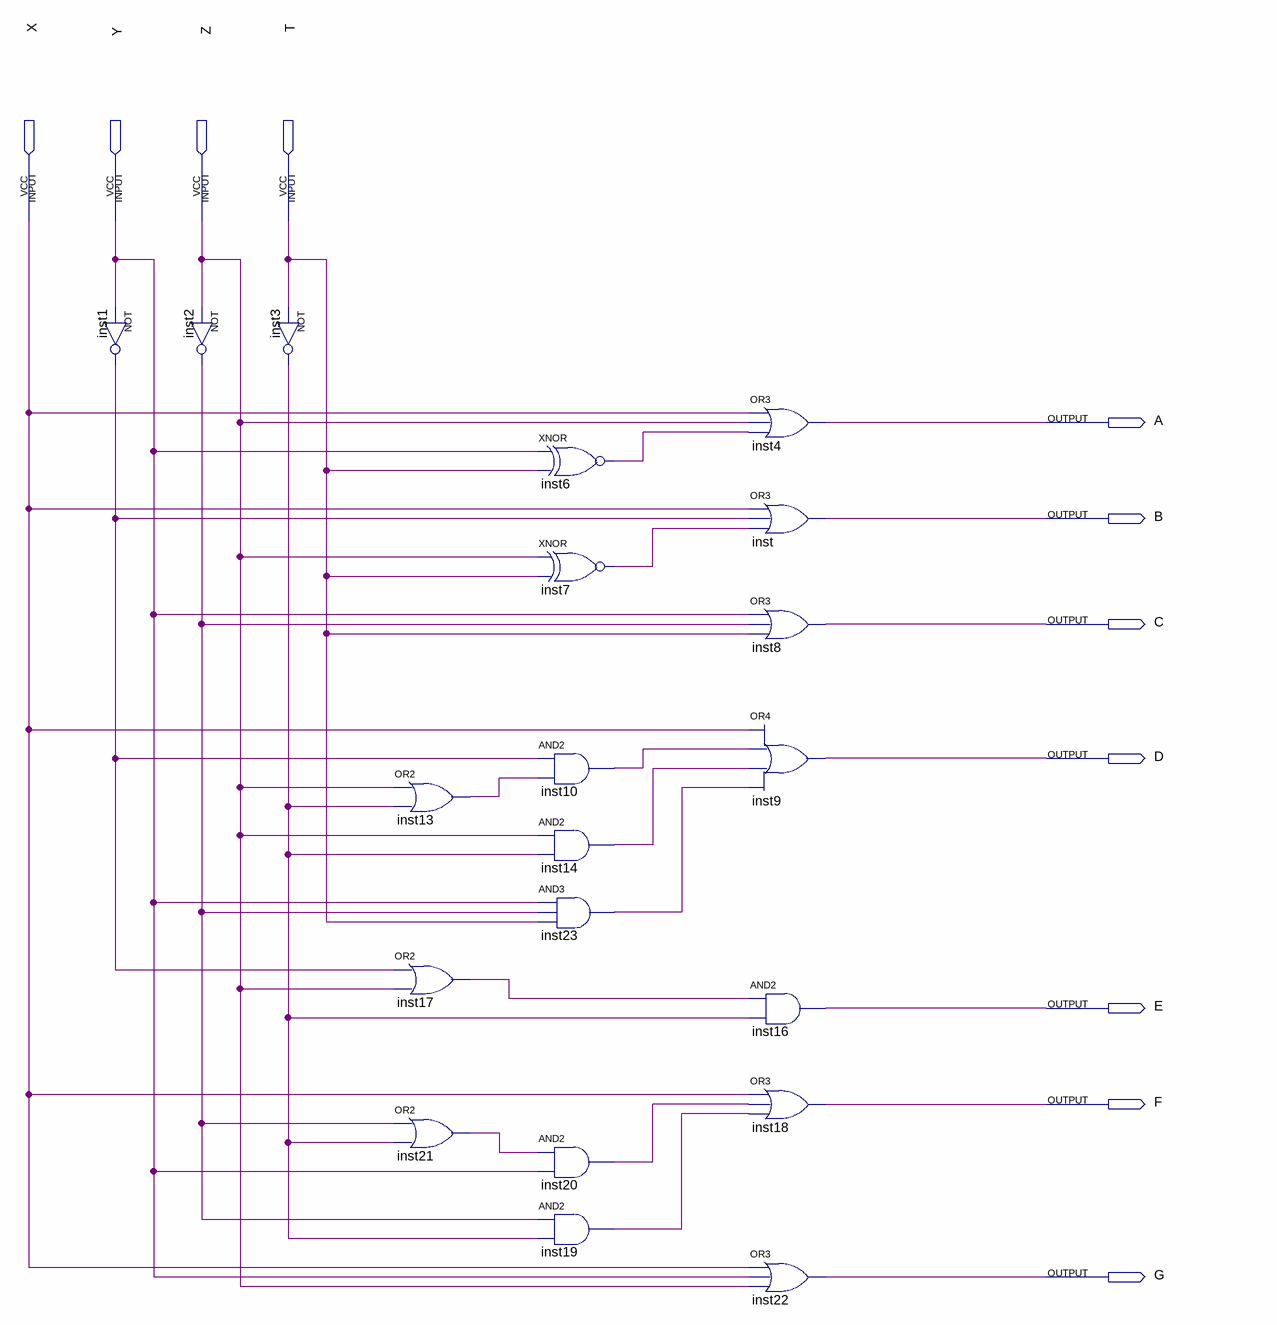
[diagram p0: schematic sheet]
// Quartus schematic NMMS3.bdf as structural Verilog: 20 symbols, 11 pins
module NMMS3 (
  input  X,
  input  Y,
  input  Z,
  input  T,
  output A,
  output B,
  output C,
  output D,
  output E,
  output F,
  output G
);

  wire inst1_out, inst2_out, inst3_out, inst6_out, inst7_out, inst10_out, inst13_out, inst14_out, inst17_out,
       inst19_out, inst20_out, inst21_out, inst23_out;

  not inst1 (inst1_out, Y);
  not inst2 (inst2_out, Z);
  not inst3 (inst3_out, T);
  or inst13 (inst13_out, Z, inst3_out);
  or inst17 (inst17_out, inst1_out, Z);
  or inst21 (inst21_out, inst2_out, inst3_out);
  xnor inst6 (inst6_out, Y, T);
  xnor inst7 (inst7_out, Z, T);
  and inst10 (inst10_out, inst1_out, inst13_out);
  and inst14 (inst14_out, Z, inst3_out);
  and inst23 (inst23_out, Y, inst2_out, T);
  and inst20 (inst20_out, inst21_out, Y);
  and inst19 (inst19_out, inst2_out, inst3_out);
  or inst4 (A, X, Z, inst6_out);
  or inst (B, X, inst1_out, inst7_out);
  or inst8 (C, Y, inst2_out, T);
  or inst9 (D, X, inst10_out, inst14_out, inst23_out);
  and inst16 (E, inst17_out, inst3_out);
  or inst18 (F, X, inst20_out, inst19_out);
  or inst22 (G, X, Y, Z);
endmodule
